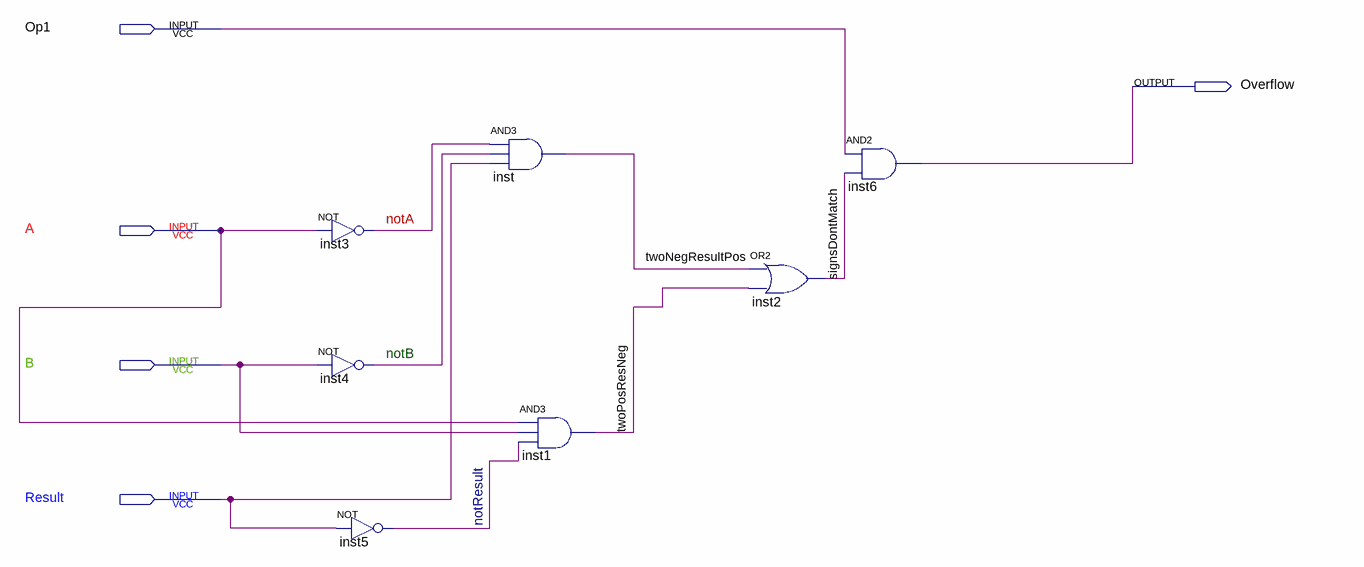
[diagram p0: schematic sheet]
// Quartus schematic OverflowDetection.bdf as structural Verilog: 7 symbols, 5 pins
module OverflowDetection (
  input  Op1,
  input  A,
  input  B,
  input  Result,
  output Overflow
);

  wire notA, notB, notResult, signsDontMatch, twoNegResultPos, twoPosResNeg;

  not inst3 (notA, A);
  not inst4 (notB, B);
  not inst5 (notResult, Result);
  and inst (twoNegResultPos, notA, notB, Result);
  and inst1 (twoPosResNeg, A, B, notResult);
  or inst2 (signsDontMatch, twoNegResultPos, twoPosResNeg);
  and inst6 (Overflow, Op1, signsDontMatch);
endmodule
